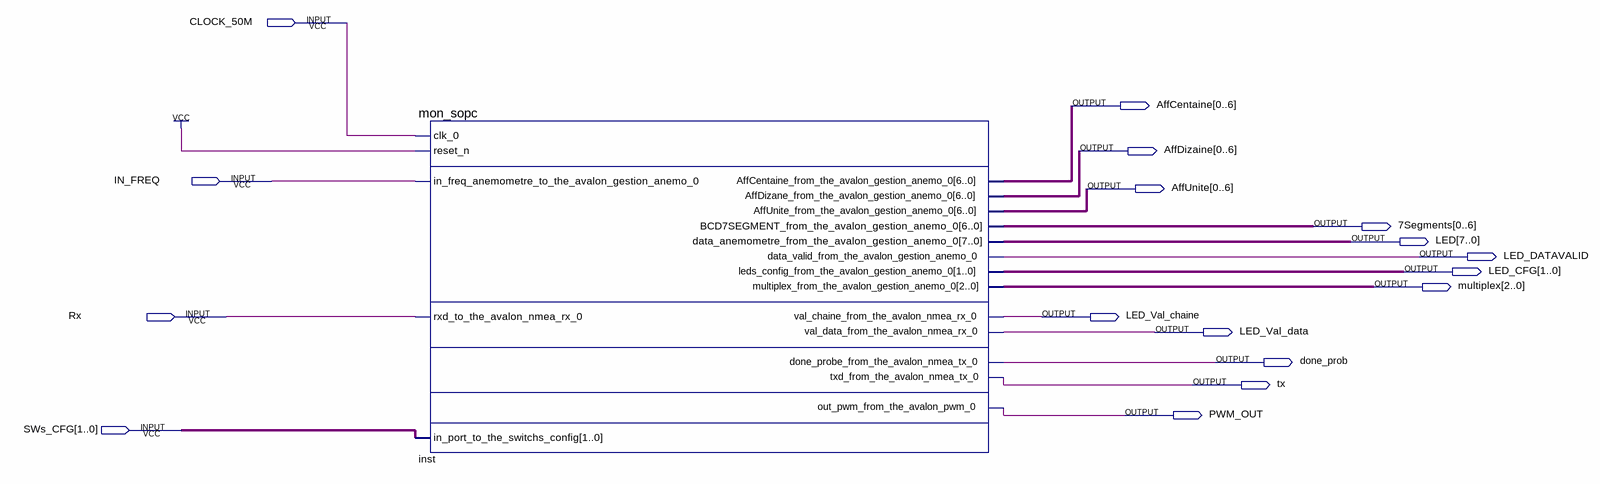
[diagram p0: schematic sheet]
// Quartus schematic sopc_be_Q11.bdf as structural Verilog: 1 symbols, 17 pins
module sopc_be_Q11 (
  input  CLOCK_50M,
  input  IN_FREQ,
  input  Rx,
  input  [1:0] SWs_CFG,
  output [0:6] AffCentaine,
  output [0:6] AffDizaine,
  output [0:6] AffUnite,
  output [0:6] \7Segments ,
  output [7:0] LED,
  output LED_DATAVALID,
  output [1:0] LED_CFG,
  output [2:0] multiplex,
  output LED_Val_chaine,
  output LED_Val_data,
  output done_prob,
  output tx,
  output PWM_OUT
);

  mon_sopc inst (
    .clk_0(CLOCK_50M), .reset_n(1'b1), .in_freq_anemometre_to_the_avalon_gestion_anemo_0(IN_FREQ),
    .rxd_to_the_avalon_nmea_rx_0(Rx), .in_port_to_the_switchs_config(SWs_CFG),
    .AffCentaine_from_the_avalon_gestion_anemo_0(AffCentaine),
    .AffDizane_from_the_avalon_gestion_anemo_0(AffDizaine),
    .AffUnite_from_the_avalon_gestion_anemo_0(AffUnite),
    .BCD7SEGMENT_from_the_avalon_gestion_anemo_0(\7Segments ),
    .data_anemometre_from_the_avalon_gestion_anemo_0(LED),
    .data_valid_from_the_avalon_gestion_anemo_0(LED_DATAVALID),
    .leds_config_from_the_avalon_gestion_anemo_0(LED_CFG),
    .multiplex_from_the_avalon_gestion_anemo_0(multiplex),
    .val_chaine_from_the_avalon_nmea_rx_0(LED_Val_chaine), .val_data_from_the_avalon_nmea_rx_0(LED_Val_data),
    .done_probe_from_the_avalon_nmea_tx_0(done_prob), .txd_from_the_avalon_nmea_tx_0(tx),
    .out_pwm_from_the_avalon_pwm_0(PWM_OUT));
endmodule
